# Altium schematic sheet 09-IMC.SchDoc: Impedance Measurement Circuit
size A2; DocumentNumber: 9; SheetNumber: 9; SheetTotal: 15
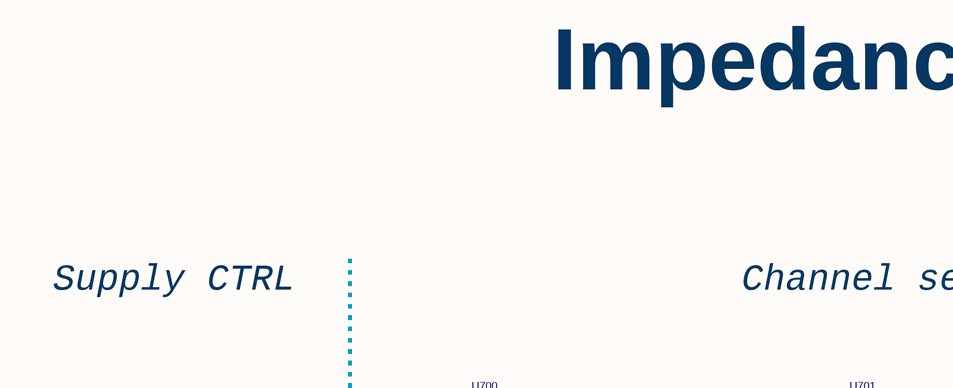
[diagram p0: 09-IMC.SchDoc, top left]
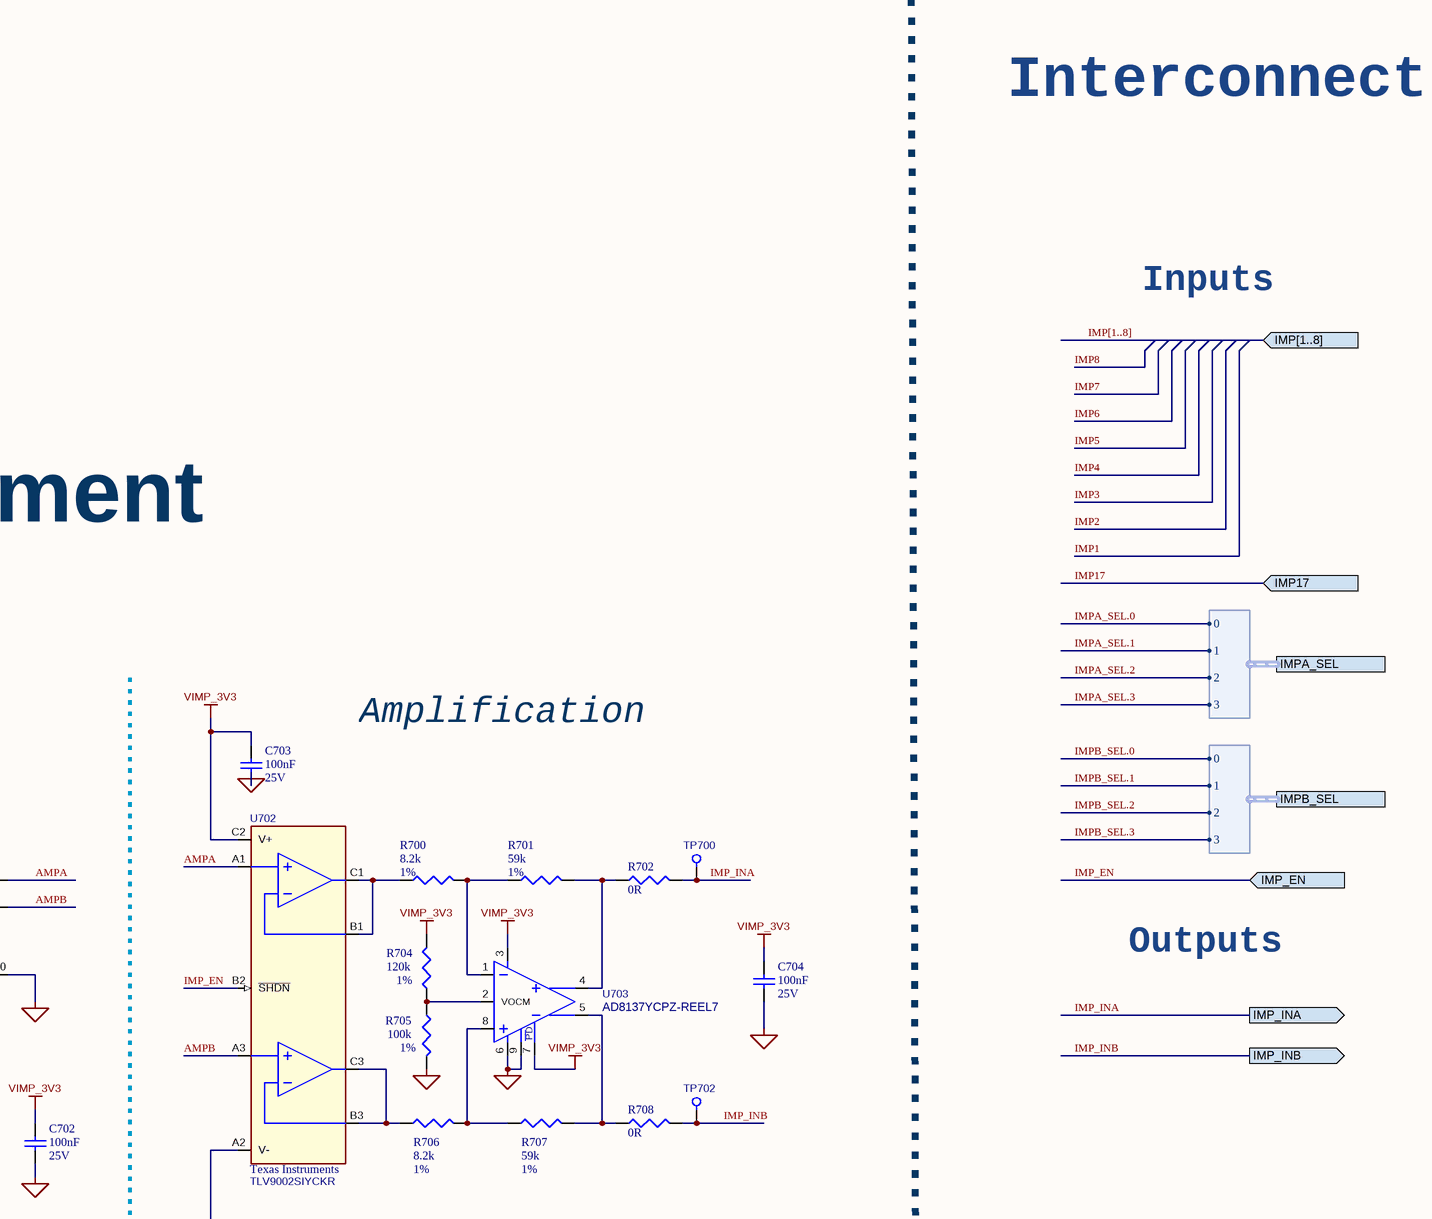
[diagram p1: 09-IMC.SchDoc, top right]
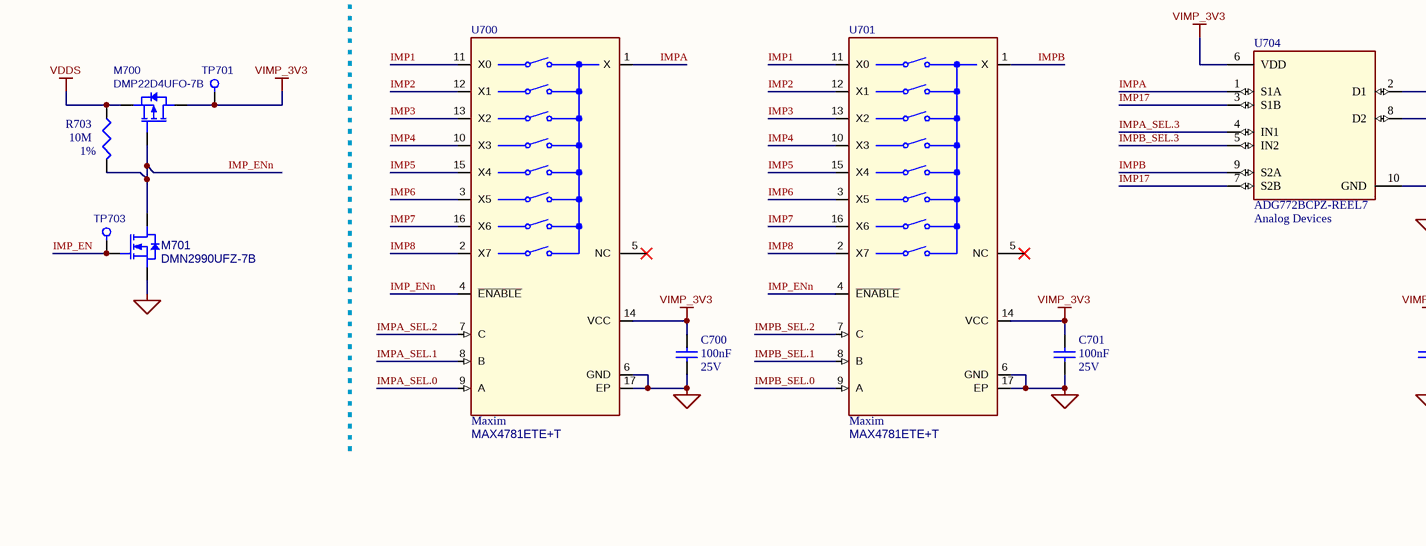
[diagram p2: 09-IMC.SchDoc, bottom left]
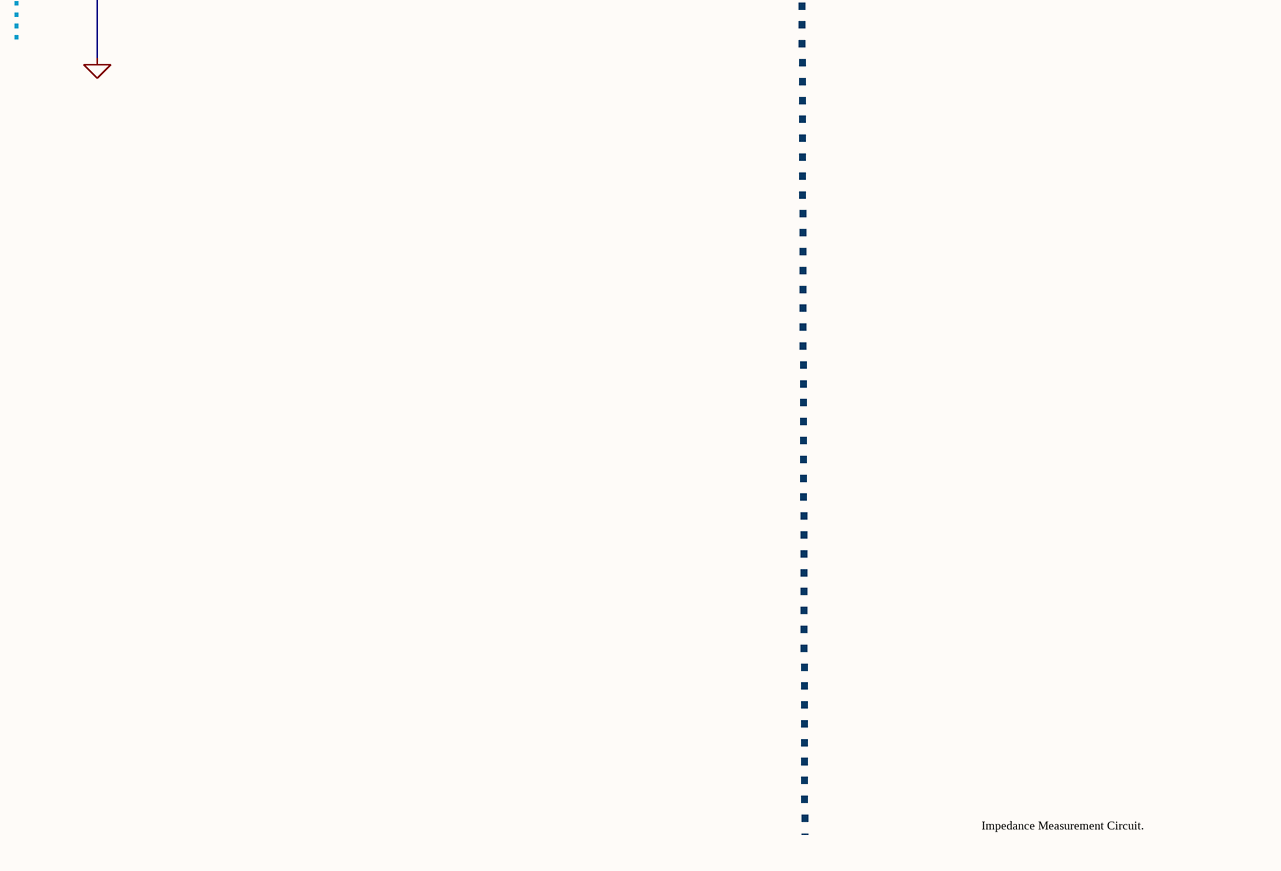
[diagram p3: 09-IMC.SchDoc, bottom right]

## Parts
C700  value 100nF  Rated DC Voltage (URdc): 25V  [C0201_C]  (hidden comment: GRM033R61E104KE14J)
C701  value 100nF  Rated DC Voltage (URdc): 25V  [C0201_C]  (hidden comment: GRM033R61E104KE14J)
C702  value 100nF  Rated DC Voltage (URdc): 25V  [C0201_C]  (hidden comment: GRM033R61E104KE14J)
C703  value 100nF  Rated DC Voltage (URdc): 25V  [C0201_C]  (hidden comment: GRM033R61E104KE14J)
C704  value 100nF  Rated DC Voltage (URdc): 25V  [C0201_C]  (hidden comment: GRM033R61E104KE14J)
M700  DMP22D4UFO-7B  [DIODESINC_X2-DFN0604-3]
M701  DMN2990UFZ-7B  [DIODESINC_X2-DFN0606-3]
R700  value 8.2k  Tolerance: 1%  [R0201_C]  (hidden comment: CRCW02018K20FNED)
R701  value 59k  Tolerance: 1%  [R0201_C]  (hidden comment: CRCW020159K0FNED)
R702  value 0R  [R0201_C]  (hidden comment: CRCW02010000Z0ED)
R703  value 10M  Tolerance: 1%  [R0201_C]  (hidden comment: CRCW020110M0FNED)
R704  value 120k  Tolerance: 1%  [R0201_C]  (hidden comment: CRCW0201120KFNED)
R705  value 100k  Tolerance: 1%  [R0201_C]  (hidden comment: CRCW0201100KFNED)
R706  value 8.2k  Tolerance: 1%  [R0201_C]  (hidden comment: CRCW02018K20FNED)
R707  value 59k  Tolerance: 1%  [R0201_C]  (hidden comment: CRCW020159K0FNED)
R708  value 0R  [R0201_C]  (hidden comment: CRCW02010000Z0ED)
TP700  Test Point  [testpad_0.9mm]  (value not drawn)  (no BOM)
TP701  Test Point  [testpad_0.9mm]  (value not drawn)  (no BOM)
TP702  Test Point  [testpad_0.9mm]  (value not drawn)  (no BOM)
TP703  Test Point  [testpad_0.9mm]  (value not drawn)  (no BOM)
U700  Manufacturer: Maxim  [MAXIM_21-0136]  (hidden comment: MAX4781ETE+T)
U701  Manufacturer: Maxim  [MAXIM_21-0136]  (hidden comment: MAX4781ETE+T)
U702  Manufacturer: Texas Instruments  [TI_YCK0009]  (hidden comment: TLV9002SIYCKR)
U703  AD8137YCPZ-REEL7  [AD_CP-8-13]
U704  ADG772BCPZ-REEL7  Manufacturer: Analog Devices  [10-Lead Mini LFCSP]

## Ports
IMP17 (in), IMP[1..8] (in), IMP_EN (in), IMP_INA (out), IMP_INB (out), IMPA_SEL (harness MUX_SEL), IMPB_SEL (harness MUX_SEL)

## Harnesses
MUX_SEL: 0, 1, 2, 3

## Nets
GND: C700.1 C701.1 C702.1 C703.1 C704.1 M701.2(S) R705.2 U700.6(GND) U700.17(EP) U701.6(GND) U701.17(EP) U702.A2(V-) U703.6(VS-) U703.9(EP) U704.10(GND)
VDDS: M700.2(S) R703.1
VIMP_3V3: C700.2 C701.2 C702.2 C703.2 C704.2 M700.3(D) R704.2 TP701.1 U700.14(VCC) U701.14(VCC) U702.C2(V+) U703.3(VS+) U703.7(~{PD}) U704.6(VDD)
AMPA: U702.A1(IN1+) U704.2(D1)
AMPB: U702.A3(IN2+) U704.8(D2)
IMP1: U700.11(X0) U701.11(X0)
IMP2: U700.12(X1) U701.12(X1)
IMP3: U700.13(X2) U701.13(X2)
IMP4: U700.10(X3) U701.10(X3)
IMP5: U700.15(X4) U701.15(X4)
IMP6: U700.3(X5) U701.3(X5)
IMP7: U700.16(X6) U701.16(X6)
IMP8: U700.2(X7) U701.2(X7)
IMP17: U704.3(S1B) U704.7(S2B) ; port IMP17
IMP_EN: M701.1(G) TP703.1 U702.B2(~{SHDN}) ; port IMP_EN
IMP_ENn: M700.1(G) M701.3(D) R703.2 U700.4(~{ENABLE}) U701.4(~{ENABLE})
IMP_INA: R702.2 TP700.1 ; port IMP_INA
IMP_INB: R708.2 TP702.1 ; port IMP_INB
IMPA: U700.1(X) U704.1(S1A)
IMPA_SEL.0: U700.9(A) ; port IMPA_SEL.0
IMPA_SEL.1: U700.8(B) ; port IMPA_SEL.1
IMPA_SEL.2: U700.7(C) ; port IMPA_SEL.2
IMPA_SEL.3: U704.4(IN1) ; port IMPA_SEL.3
IMPB: U701.1(X) U704.9(S2A)
IMPB_SEL.0: U701.9(A) ; port IMPB_SEL.0
IMPB_SEL.1: U701.8(B) ; port IMPB_SEL.1
IMPB_SEL.2: U701.7(C) ; port IMPB_SEL.2
IMPB_SEL.3: U704.5(IN2) ; port IMPB_SEL.3
NetR700_1: R700.1 U702.B1(IN1-) U702.C1(OUT1)
NetR700_2: R700.2 R701.1 U703.1(-IN)
NetR701_2: R701.2 R702.1 U703.4(+OUT)
NetR704_1: R704.1 R705.1 U703.2(VOCM)
NetR706_1: R706.1 U702.B3(IN2-) U702.C3(OUT2)
NetR706_2: R706.2 R707.1 U703.8(+IN)
NetR707_2: R707.2 R708.1 U703.5(-OUT)

Not connected (* = marked no-connect by the designer): U700 5(NC)*; U701 5(NC)*

## Buses and harness runs
bus IMP[1..8] = port IMP[1..8]

## Notes on the sheet
- Interconnect
- Inputs
- Impedance Measurement
- Supply CTRL
- Channel selection
- Amplification
- Outputs
- Impedance Measurement Circuit.
- Project:
- Schematic:
- Design by:
- Date:
- Ver:
- .
- Comments:
- Reviewed by:
- (in symbol AD8137YCPZ-REEL7) PD

## Library data of the parts
C700-C704 = GRM033R61E104KE14J: Ceramic Capacitor, Multilayer, Ceramic, 25V, 10% +Tol, 10% -Tol, X5R, 15% TC, 0.1uF, Surface Mount, 0201; Manufacturer: Murata; Multilayer: Yes; Category: Ceramic Capacitors; Supplier: Digikey; Supplier Part Number: 490-14571-1-ND; Manufacturer Part Number: GRM033R61E104KE14J; RoHS: Yes; Stock: 1540851; Pricing: 1=0,1, 10=0,033, 50=0,0192, 100=0,0148, 500=0,01118, 1000=0,00878, 2500=0,00798, 5000=0,00734 (USD); Mounting Technology: Surface Mount; Pins: 2; Dielectric Material: Ceramic; Package Shape: Rectangular; Case/Package: 0201; Terminal Finish: Nickel; Min Operating Temperature: -55°C; Max Operating Temperature: 85°C; JESD-609 Code: e3; Capacitor Type: Ceramic; Tolerance  (fill in as +-): 10%; Package Style: SMTMeter; Packaging: Tape and Reel; Tolerance (fill in as +-): 10%; Temperature Characteristics Code: X5R; Termination: Wraparound; Length: 0.6mm; Width: 0.3mm; Height: 0.3mm; Reach SVHC Compliant: Yes; RoHS Compliant: Yes; ComponentLink1URL: https://psearch.en.murata.com:443/capacitor/product/GRM033R61E104KE14%23.pdf?src-supplier=IHS+Markit; ComponentLink1Description: https://psearch.en.murata.com:443/capacitor/product/GRM033R61E104KE14%23.pdf?src-supplier=IHS+Markit; ComponentLink2URL: http://www.mouser.com/ds/2/281/c02e-2905.pdf?src-supplier=Mouser; ComponentLink2Description: http://www.mouser.com/ds/2/281/c02e-2905.pdf?src-supplier=Mouser; ComponentLink3URL: http://search.murata.co.jp/Ceramy/image/img/A01X/G101/ENG/GRM033R61E104KE14-01.pdf?src-supplier=Digikey; ComponentLink3Description: http://search.murata.co.jp/Ceramy/image/img/A01X/G101/ENG/GRM033R61E104KE14-01.pdf?src-supplier=Digikey; ComponentLink4URL: https://search.murata.co.jp/Ceramy/image/img/A01X/G101/ENG/GRM033R61E104KE14-01.pdf?src-supplier=Digikey; ComponentLink4Description: https://search.murata.co.jp/Ceramy/image/img/A01X/G101/ENG/GRM033R61E104KE14-01.pdf?src-supplier=Digikey; Supplier 1: Arrow Electronics; Supplier Part Number 1: GRM033R61E104KE14J
M700 = DMP22D4UFO-7B: MOSFET, P-chan, -20V, -383mA, DFN0604; Manufacturer: Diodes Inc; Medical Grade MFR: TBD; Review: 020823; Category: Transistor; Length (mm): 0.60 ±0.05; Medical Grade MFR PN: TBD; PCB Footprint: TBD; Rating: -20V; Thickness (mm): 0.36 ±0.04; Value: DMP22D4UFO-7B; Width (mm): 0.40 ±0.05; Supplier 1: Digi-Key; Supplier Part Number 1: 31-DMP22D4UFO-7BCT-ND; Status: Approved; Manufacturer Part Number: DMP22D4UFO-7B
M701 = DMN2990UFZ-7B: MOSFET, N-Chan, 20V, 170mA, DFN0606; Manufacturer: Diodes Inc; Medical Grade MFR: TBD; Review: 020823; Category: Transistor; Length (mm): 0.62 ±0.05; Medical Grade MFR PN: TBD; PCB Footprint: TBD; Rating: 20V; Thickness (mm): 0.38 ±0.02; Value: DMN2990UFZ-7B; Width (mm): 0.62 ±0.05; Supplier 1: Digi-Key; Supplier Part Number 1: DMN2990UFZ-7BDICT-ND; Status: Approved; Manufacturer Part Number: DMN2990UFZ-7B
R700 R706 = CRCW02018K20FNED: Fixed Resistor, Metal Glaze/thick Film, 0.05W, 8200ohm, 30V, 1% +/-Tol, 200ppm/Cel, Surface Mount, 0201; Manufacturer: Vishay; Medical Grade MFR: TBD; Power: 50mW; Rated Temperature: 70°C; Temperature Coefficient: 200ppm/°C; Package Height: 0.23mm; Package Length: 0.6mm; Package Width: 0.3mm; Reference Standard: AEC-Q200; Manufacturer Part Number: CRCW02018K20FNED; RoHS: Yes; Category: Chip SMD Resistors; Mounting Technology: Surface Mount; Pins: 2; Package Shape: Rectangular; Case/Package: 0201; Terminal Finish: Nickel; Min Operating Temperature: -55°C; Max Operating Temperature: 155°C; Resistor Type: FIXED RESISTOR; Construction: Chip; Package Style: SMTMeter; Technology: METAL GLAZE/THICK FILM; Termination: Wraparound; Working Voltage: 30V; Reach SVHC Compliant: Yes; RoHS Compliant: Yes; ComponentLink1URL: https://datasheet.ciiva.com:443/pdfs/VipMasterIC/IC/VISH/VISH-S-A0002932828/VISH-S-A0002932828-1.pdf?src-supplier=IHS+Markit; ComponentLink1Description: https://datasheet.ciiva.com:443/pdfs/VipMasterIC/IC/VISH/VISH-S-A0002932828/VISH-S-A0002932828-1.pdf?src-supplier=IHS+Markit; ComponentLink2URL: https://datasheet.ciiva.com/7983/1719906-7983324.pdf?src-supplier=Element14; ComponentLink2Description: https://datasheet.ciiva.com/7983/1719906-7983324.pdf?src-supplier=Element14; ComponentLink3URL: https://datasheet.ciiva.com/7983/1719906-7983323.pdf?src-supplier=Element14; ComponentLink3Description: https://datasheet.ciiva.com/7983/1719906-7983323.pdf?src-supplier=Element14; ComponentLink4URL: https://datasheet.ciiva.com/22692/1719906-22692751.pdf?src-supplier=Element14; ComponentLink4Description: https://datasheet.ciiva.com/22692/1719906-22692751.pdf?src-supplier=Element14; ComponentLink5URL: https://datasheet.ciiva.com/22665/1825492-22665818.pdf?src-supplier=Element14; ComponentLink5Description: https://datasheet.ciiva.com/22665/1825492-22665818.pdf?src-supplier=Element14; ComponentLink6URL: https://datasheet.ciiva.com/2474/crcw0201e3-2474801.pdf?src-supplier=Digikey; ComponentLink6Description: https://datasheet.ciiva.com/2474/crcw0201e3-2474801.pdf?src-supplier=Digikey; ComponentLink7URL: https://datasheet.ciiva.com/2474/crcw0201e3-2474802.pdf?src-supplier=Digikey; ComponentLink7Description: https://datasheet.ciiva.com/2474/crcw0201e3-2474802.pdf?src-supplier=Digikey; ComponentLink8URL: https://datasheet.ciiva.com/2474/crcw0201e3-2474800.pdf?src-supplier=Digikey; ComponentLink8Description: https://datasheet.ciiva.com/2474/crcw0201e3-2474800.pdf?src-supplier=Digikey; ComponentLink9URL: https://datasheet.ciiva.com/22871/70202042-22871422.pdf?src-supplier=Allied+Electronics; ComponentLink9Description: https://datasheet.ciiva.com/22871/70202042-22871422.pdf?src-supplier=Allied+Electronics; ComponentLink10URL: https://datasheet.ciiva.com/3255/crcw0201e3-3255929.pdf?src-supplier=Avnet; ComponentLink10Description: https://datasheet.ciiva.com/3255/crcw0201e3-3255929.pdf?src-supplier=Avnet; Medical Grade MFR PN: TBD; Supplier 1: Digikey; Supplier Part Number 1: 541-CRCW02018K20FNEDCT-ND
R701 R707 = CRCW020159K0FNED: Fixed Resistor, Metal Glaze/thick Film, 0.05W, 59000ohm, 30V, 1% +/-Tol, 200ppm/Cel, Surface Mount, 0201; Manufacturer: Vishay; Medical Grade MFR: TBD; Power: 50mW; Rated Temperature: 70°C; Temperature Coefficient: 200ppm/°C; Package Height: 0.23mm; Package Length: 0.6mm; Package Width: 0.3mm; Reference Standard: AEC-Q200; Manufacturer Part Number: CRCW020159K0FNED; RoHS: Yes; Category: Chip SMD Resistors; Mounting Technology: Surface Mount; Pins: 2; Package Shape: Rectangular; Case/Package: 0201; Terminal Finish: Nickel; Min Operating Temperature: -55°C; Max Operating Temperature: 155°C; Resistor Type: FIXED RESISTOR; Construction: Chip; Package Style: SMTMeter; Technology: METAL GLAZE/THICK FILM; Termination: Wraparound; Working Voltage: 30V; Reach SVHC Compliant: Yes; RoHS Compliant: Yes; ComponentLink1URL: https://datasheet.ciiva.com:443/pdfs/VipMasterIC/IC/VISH/VISH-S-A0002932828/VISH-S-A0002932828-1.pdf?src-supplier=IHS+Markit; ComponentLink1Description: https://datasheet.ciiva.com:443/pdfs/VipMasterIC/IC/VISH/VISH-S-A0002932828/VISH-S-A0002932828-1.pdf?src-supplier=IHS+Markit; ComponentLink2URL: https://datasheet.ciiva.com/7983/1719906-7983324.pdf?src-supplier=Element14; ComponentLink2Description: https://datasheet.ciiva.com/7983/1719906-7983324.pdf?src-supplier=Element14; ComponentLink3URL: https://datasheet.ciiva.com/7983/1719906-7983323.pdf?src-supplier=Element14; ComponentLink3Description: https://datasheet.ciiva.com/7983/1719906-7983323.pdf?src-supplier=Element14; ComponentLink4URL: https://datasheet.ciiva.com/22692/1719906-22692751.pdf?src-supplier=Element14; ComponentLink4Description: https://datasheet.ciiva.com/22692/1719906-22692751.pdf?src-supplier=Element14; ComponentLink5URL: https://datasheet.ciiva.com/22665/1825492-22665818.pdf?src-supplier=Element14; ComponentLink5Description: https://datasheet.ciiva.com/22665/1825492-22665818.pdf?src-supplier=Element14; ComponentLink6URL: https://datasheet.ciiva.com/2474/crcw0201e3-2474801.pdf?src-supplier=Digikey; ComponentLink6Description: https://datasheet.ciiva.com/2474/crcw0201e3-2474801.pdf?src-supplier=Digikey; ComponentLink7URL: https://datasheet.ciiva.com/2474/crcw0201e3-2474802.pdf?src-supplier=Digikey; ComponentLink7Description: https://datasheet.ciiva.com/2474/crcw0201e3-2474802.pdf?src-supplier=Digikey; ComponentLink8URL: https://datasheet.ciiva.com/2474/crcw0201e3-2474800.pdf?src-supplier=Digikey; ComponentLink8Description: https://datasheet.ciiva.com/2474/crcw0201e3-2474800.pdf?src-supplier=Digikey; ComponentLink9URL: https://datasheet.ciiva.com/22871/70202042-22871422.pdf?src-supplier=Allied+Electronics; ComponentLink9Description: https://datasheet.ciiva.com/22871/70202042-22871422.pdf?src-supplier=Allied+Electronics; ComponentLink10URL: https://datasheet.ciiva.com/3255/crcw0201e3-3255929.pdf?src-supplier=Avnet; ComponentLink10Description: https://datasheet.ciiva.com/3255/crcw0201e3-3255929.pdf?src-supplier=Avnet; Medical Grade MFR PN: TBD; Supplier 1: Digikey; Supplier Part Number 1: 541-CRCW020159K0FNEDCT-ND
R702 R708 = CRCW02010000Z0ED: Fixed Resistor, Metal Glaze/thick Film, 0.05W, 0ohm, Surface Mount, 0201; Manufacturer: Vishay; Medical Grade MFR: Mini-Systems; Medical Grade MFR PN: MWA96SM-0000F-NS62TR; Power: 50mW; Rated Temperature: 70°C; Package Height: 0.23mm; Package Length: 0.6mm; Package Width: 0.3mm; Reference Standard: AEC-Q200; Category: Chip SMD Resistors; Supplier: Digikey; Supplier Part Number: 541-0.0AGCT-ND; Manufacturer Part Number: CRCW02010000Z0ED; RoHS: Yes; Stock: 701366; Pricing: 1=0,1, 10=0,034, 25=0,026, 50=0,0198, 100=0,0138, 250=0,01112, 500=0,0089, 1000=0,00655, 5000=0,0047 (USD); Mounting Technology: Surface Mount; Pins: 2; Package Shape: Rectangular; Case/Package: 0201; Terminal Finish: Nickel; Min Operating Temperature: -55°C; Max Operating Temperature: 155°C; JESD-609 Code: e3; Resistor Type: FIXED RESISTOR; Construction: Chip; Package Style: SMTMeter; Packaging: Tape and Reel; Technology: METAL GLAZE/THICK FILM; Termination: Wraparound; Reach SVHC Compliant: Yes; RoHS Compliant: Yes; ComponentLink1URL: https://datasheet.ciiva.com:443/pdfs/VipMasterIC/IC/VISH/VISH-S-A0002932828/VISH-S-A0002932828-1.pdf?src-supplier=IHS+Markit; ComponentLink1Description: https://datasheet.ciiva.com:443/pdfs/VipMasterIC/IC/VISH/VISH-S-A0002932828/VISH-S-A0002932828-1.pdf?src-supplier=IHS+Markit; ComponentLink2URL: https://datasheet.ciiva.com/2471/crcw0201e3-2471712.pdf?src-supplier=Digikey; ComponentLink2Description: https://datasheet.ciiva.com/2471/crcw0201e3-2471712.pdf?src-supplier=Digikey; ComponentLink3URL: https://datasheet.ciiva.com/7841/1719906-7841431.pdf?src-supplier=Element14; ComponentLink3Description: https://datasheet.ciiva.com/7841/1719906-7841431.pdf?src-supplier=Element14; ComponentLink4URL: https://datasheet.ciiva.com/7841/1719906-7841430.pdf?src-supplier=Element14; ComponentLink4Description: https://datasheet.ciiva.com/7841/1719906-7841430.pdf?src-supplier=Element14; ComponentLink5URL: https://datasheet.ciiva.com/22665/1847332-22665688.pdf?src-supplier=Element14; ComponentLink5Description: https://datasheet.ciiva.com/22665/1847332-22665688.pdf?src-supplier=Element14; ComponentLink6URL: https://datasheet.ciiva.com/2471/crcw0201e3-2471713.pdf?src-supplier=Digikey; ComponentLink6Description: https://datasheet.ciiva.com/2471/crcw0201e3-2471713.pdf?src-supplier=Digikey; ComponentLink7URL: https://datasheet.ciiva.com/2471/crcw0201e3-2471711.pdf?src-supplier=Digikey; ComponentLink7Description: https://datasheet.ciiva.com/2471/crcw0201e3-2471711.pdf?src-supplier=Digikey; ComponentLink8URL: https://datasheet.ciiva.com/16757/70202042-16757849.pdf?src-supplier=Allied+Electronics; ComponentLink8Description: https://datasheet.ciiva.com/16757/70202042-16757849.pdf?src-supplier=Allied+Electronics; ComponentLink9URL: https://datasheet.ciiva.com/16436/crcw0201e3-16436237.pdf?src-supplier=Future+Electronics; ComponentLink9Description: https://datasheet.ciiva.com/16436/crcw0201e3-16436237.pdf?src-supplier=Future+Electronics; Supplier 1: Digikey; Supplier Part Number 1: 541-0.0AGDKR-ND
R703 = CRCW020110M0FNED: Fixed Resistor, Metal Glaze/thick Film, 0.05W, 10000000ohm, 30V, 1% +/-Tol, 200ppm/Cel, Surface Mount, 0201; Manufacturer: Vishay Draloric; Medical Grade MFR: Mini-Systems; Medical Grade MFR PN: MWA96SM-1005F-NS62TR; Power: 50mW; Rated Temperature: 70°C; Temperature Coefficient: 200ppm/°C; Category: Chip SMD Resistors; Supplier: Mouser; Supplier Part Number: 71-CRCW020110M0FNED; Manufacturer Part Number: CRCW020110M0FNED; RoHS: Yes; Stock: 159754; Pricing: 1=0,1, 10=0,024, 50=0,024, 100=0,014, 1000=0,011, 10000=0,006 (USD); Mounting Technology: Surface Mount; Pins: 2; Package Shape: Rectangular; Case/Package: 0201; Terminal Finish: Nickel; Min Operating Temperature: -55°C; Max Operating Temperature: 155°C; JESD-609 Code: e3; Resistor Type: FIXED RESISTOR; Packaging: Tape and Reel; Technology: METAL GLAZE/THICK FILM; Termination: Wraparound; Working Voltage: 30V; Reach SVHC Compliant: Yes; RoHS Compliant: Yes; ComponentLink1URL: https://datasheet.ciiva.com:443/pdfs/VipMasterIC/IC/VISH/VISH-S-A0002932828/VISH-S-A0002932828-1.pdf?src-supplier=IHS+Markit; ComponentLink1Description: https://datasheet.ciiva.com:443/pdfs/VipMasterIC/IC/VISH/VISH-S-A0002932828/VISH-S-A0002932828-1.pdf?src-supplier=IHS+Markit; ComponentLink2URL: https://datasheet.ciiva.com/7673/1719906-7673177.pdf?src-supplier=Element14; ComponentLink2Description: https://datasheet.ciiva.com/7673/1719906-7673177.pdf?src-supplier=Element14; ComponentLink3URL: https://datasheet.ciiva.com/7673/1719906-7673178.pdf?src-supplier=Element14; ComponentLink3Description: https://datasheet.ciiva.com/7673/1719906-7673178.pdf?src-supplier=Element14; ComponentLink4URL: https://datasheet.ciiva.com/22692/1719906-22692711.pdf?src-supplier=Element14; ComponentLink4Description: https://datasheet.ciiva.com/22692/1719906-22692711.pdf?src-supplier=Element14; ComponentLink5URL: https://datasheet.ciiva.com/22665/1700795-22665701.pdf?src-supplier=Element14; ComponentLink5Description: https://datasheet.ciiva.com/22665/1700795-22665701.pdf?src-supplier=Element14; Supplier 1: Digikey; Supplier Part Number 1: 541-CRCW020110M0FNEDCT-ND
R704 = CRCW0201120KFNED: Fixed Resistor, Metal Glaze/thick Film, 0.05W, 120000ohm, 30V, 1% +/-Tol, 200ppm/Cel, Surface Mount, 0201; Manufacturer: Vishay Dale; Medical Grade MFR: TBD; Power: 50mW; Rated Temperature: 70°C; Temperature Coefficient: 200ppm/°C; Manufacturer Part Number: CRCW0201120KFNED; RoHS: Yes; Category: Chip SMD Resistors; Mounting Technology: Surface Mount; Pins: 2; Package Shape: Rectangular; Case/Package: 0201; Terminal Finish: Nickel; Min Operating Temperature: -55°C; Max Operating Temperature: 155°C; Resistor Type: FIXED RESISTOR; Technology: METAL GLAZE/THICK FILM; Termination: Wraparound; Working Voltage: 30V; Reach SVHC Compliant: Yes; RoHS Compliant: Yes; ComponentLink1URL: https://datasheet.ciiva.com:443/pdfs/VipMasterIC/IC/VISH/VISH-S-A0002932828/VISH-S-A0002932828-1.pdf?src-supplier=IHS+Markit; ComponentLink1Description: https://datasheet.ciiva.com:443/pdfs/VipMasterIC/IC/VISH/VISH-S-A0002932828/VISH-S-A0002932828-1.pdf?src-supplier=IHS+Markit; ComponentLink2URL: https://datasheet.ciiva.com/7800/1719906-7800943.pdf?src-supplier=Element14; ComponentLink2Description: https://datasheet.ciiva.com/7800/1719906-7800943.pdf?src-supplier=Element14; ComponentLink3URL: https://datasheet.ciiva.com/22682/1700795-22682622.pdf?src-supplier=Element14; ComponentLink3Description: https://datasheet.ciiva.com/22682/1700795-22682622.pdf?src-supplier=Element14; ComponentLink4URL: https://datasheet.ciiva.com/22702/1719906-22702669.pdf?src-supplier=Element14; ComponentLink4Description: https://datasheet.ciiva.com/22702/1719906-22702669.pdf?src-supplier=Element14; ComponentLink5URL: https://datasheet.ciiva.com/29926/crcw0201e3-29926006.pdf?src-supplier=Avnet; ComponentLink5Description: https://datasheet.ciiva.com/29926/crcw0201e3-29926006.pdf?src-supplier=Avnet; Medical Grade MFR PN: TBD; Supplier 1: Digikey; Supplier Part Number 1: 541-CRCW0201120KFNEDDKR-ND
R705 = CRCW0201100KFNED: Fixed Resistor, Metal Glaze/thick Film, 0.05W, 100000ohm, 30V, 1% +/-Tol, 200ppm/Cel, Surface Mount, 0201; Manufacturer: Vishay; Medical Grade MFR: Mini-Systems; Medical Grade MFR PN: MWA96SM-1003F-NS62TR; Power: 50mW; Rated Temperature: 70°C; Temperature Coefficient: 200ppm/°C; Package Height: 0.23mm; Package Length: 0.6mm; Package Width: 0.3mm; Reference Standard: AEC-Q200; Category: Chip SMD Resistors; Supplier: Digikey; Supplier Part Number: 541-100KABCT-ND; Manufacturer Part Number: CRCW0201100KFNED; RoHS: Yes; Stock: 8252; Pricing: 1=0,1, 10=0,037, 50=0,0242, 100=0,0204, 500=0,01426, 1000=0,01241, 5000=0,00924 (USD); Mounting Technology: Surface Mount; Pins: 2; Package Shape: Rectangular; Case/Package: 0201; Terminal Finish: Nickel; Min Operating Temperature: -55°C; Max Operating Temperature: 155°C; JESD-609 Code: e3; Resistor Type: FIXED RESISTOR; Construction: Chip; Package Style: SMTMeter; Packaging: Tape and Reel; Technology: METAL GLAZE/THICK FILM; Termination: Wraparound; Working Voltage: 30V; Reach SVHC Compliant: Yes; RoHS Compliant: Yes; ComponentLink1URL: https://datasheet.ciiva.com:443/pdfs/VipMasterIC/IC/VISH/VISH-S-A0002932828/VISH-S-A0002932828-1.pdf?src-supplier=IHS+Markit; ComponentLink1Description: https://datasheet.ciiva.com:443/pdfs/VipMasterIC/IC/VISH/VISH-S-A0002932828/VISH-S-A0002932828-1.pdf?src-supplier=IHS+Markit; ComponentLink2URL: https://datasheet.ciiva.com/2474/crcw0201e3-2474797.pdf?src-supplier=Digikey; ComponentLink2Description: https://datasheet.ciiva.com/2474/crcw0201e3-2474797.pdf?src-supplier=Digikey; ComponentLink3URL: https://datasheet.ciiva.com/2474/crcw0201e3-2474798.pdf?src-supplier=Digikey; ComponentLink3Description: https://datasheet.ciiva.com/2474/crcw0201e3-2474798.pdf?src-supplier=Digikey; ComponentLink4URL: https://datasheet.ciiva.com/2474/crcw0201e3-2474799.pdf?src-supplier=Digikey; ComponentLink4Description: https://datasheet.ciiva.com/2474/crcw0201e3-2474799.pdf?src-supplier=Digikey; ComponentLink5URL: https://datasheet.ciiva.com/16436/dcrcwe3-16436220.pdf?src-supplier=Future+Electronics; ComponentLink5Description: https://datasheet.ciiva.com/16436/dcrcwe3-16436220.pdf?src-supplier=Future+Electronics; ComponentLink6URL: https://datasheet.ciiva.com/28634/1847332-28634462.pdf?src-supplier=Element14; ComponentLink6Description: https://datasheet.ciiva.com/28634/1847332-28634462.pdf?src-supplier=Element14; ComponentLink7URL: https://datasheet.ciiva.com/22665/1700795-22665689.pdf?src-supplier=Element14; ComponentLink7Description: https://datasheet.ciiva.com/22665/1700795-22665689.pdf?src-supplier=Element14; ComponentLink8URL: https://datasheet.ciiva.com/22870/70202042-22870476.pdf?src-supplier=Allied+Electronics; ComponentLink8Description: https://datasheet.ciiva.com/22870/70202042-22870476.pdf?src-supplier=Allied+Electronics; ComponentLink9URL: https://datasheet.ciiva.com/16777/70202042-16777655.pdf?src-supplier=Allied+Electronics; ComponentLink9Description: https://datasheet.ciiva.com/16777/70202042-16777655.pdf?src-supplier=Allied+Electronics; Supplier 1: Digikey; Supplier Part Number 1: 541-100KABCT-ND
TP700-TP703 = Test Point: Test pad, 0.90mm circular pad; PCB Footprint: testpad_0p90mm; Length (mm): 0.90; Manufacturer: N/A; Manufacturer PN: N/A; Medical Grade MFR: N/A; Medical Grade MFR PN: N/A; Rating: N/A; Thickness (mm): N/A; Value: Test point; Width (mm): 0.90; Category: Test point; Status: *; Review: *
U700 U701 = MAX4781ETE+T: Multiplexer, 8:1, 0.7 ohms, QFN-16; Medical Grade MFR: TBD; Category: IC; Length (mm): 3.00 ±0.10; Medical Grade MFR PN: TBD; Package Description: TBD; PCB Footprint: TBD; Rating: TBD; Thickness (mm): 0.75 ±0.05; Value: MAX4781ETE+T; Width (mm): 3.00 ±0.10; Supplier 1: Digi-Key; Supplier Part Number 1: MAX4781ETE+TCT-ND; Status: *; Review: *; Manufacturer Part Number: MAX4781ETE+T
U702 = TLV9002SIYCKR_B: Op Amp, Dual, Rail-to-Rail, 1MHz, BGA-9; Medical Grade MFR: TBD; Rating: 5.5V; Category: IC; Length (mm): 0.95 ±0.03; Medical Grade MFR PN: TBD; PCB Footprint: TBD; Thickness (mm): 0.33; Value: TLV9002SIYCKR; Width (mm): 0.95 ±0.03; Package Description: TBD; Supplier 1: Mouser; Supplier Part Number 1: 595-TLV9002SIYCKR; Status: *; Review: *; Manufacturer Part Number: TLV9002SIYCKR
U703 = AD8137YCPZ-REEL7: Differential Amplifier, 110 MHz, DFN-8; Manufacturer: Analog Devices; Medical Grade MFR: TBD; Category: IC; Length (mm): 3.00 ±0.10; Medical Grade MFR PN: TBD; Package Description: TBD; PCB Footprint: TBD; Rating: TBD; Thickness (mm): 0.75 ±0.05; Value: AD8137YCPZ-REEL7; Width (mm): 3.00 ±0.10; Supplier 1: Digi-Key; Supplier Part Number 1: 505-AD8137YCPZ-REEL7CT-ND; Status: *; Review: *; Manufacturer Part Number: AD8137YCPZ-REEL7
U704 = ADG772BCPZ-REEL7: SPDT, 2 Func, 1 Channel, CMOS; Number of Channels: 1; Channels: 2; Off-state Isolation-Nom: 73dB; On-state Resistance Match-Nom: 40mR; On-state Resistance-Max (Ron): 8.8R; Max Supply Voltage: 3.6V; Min Supply Voltage: 2.7V; Nominal Supply Voltage: 3.3V; Switch-off Time-Max: 9.5ns; Switch-on Time-Max: 12.5ns; Power Supplies: 3/3.3V; Switching: BREAK-BEFORE-MAKEV; Time @ Peak Reflow Temperature-Max (s): 40s; Supply Current-Max (Isup): 1uA; Qualification Status: Not Qualified; Supplier: Arrow Electronics; Supplier Part Number: ADG772BCPZ-REEL7; Manufacturer Part Number: ADG772BCPZ-REEL7; RoHS: Yes; Category: Interface ICs; Stock: 2157; Pricing: 1=2,564, 10=2,288, 25=2,22, 100=1,902, 250=1,788, 500=1,61, 1000=1,321 (USD); Case/Package: VQCCN; Pins: 10; Package Shape: Rectangular; Terminal Finish: Nickel; Min Operating Temperature: -40°C; Max Operating Temperature: 85°C; JESD-609 Code: e4; Throw Configuration: SPDT; Package Style: CHIP CARRIER, VERY THIN PROFILEMeter; Surface Mount: Yes; Technology: CMOS; Terminal Form: No Lead; Terminal Position: QUAD; Moisture Sensitivity Level: 1; Peak Reflow Temperature (Cel): 260°C; Length: 1.6mm; Width: 1.3mm; Height - Seated (Max): 0.6mm; Terminal Pitch: 0.4mm; Temperature Grade: INDUSTRIAL; RoHS Compliant: Yes; Reach SVHC Compliant: Yes; ComponentLink1URL: https://datasheet.ciiva.com:443/pdfs/VipMasterIC/IC/ANDI/ANDI-S-A0002823372/ANDI-S-A0002823372-1.pdf?src-supplier=IHS+Markit; ComponentLink1Description: https://datasheet.ciiva.com:443/pdfs/VipMasterIC/IC/ANDI/ANDI-S-A0002823372/ANDI-S-A0002823372-1.pdf?src-supplier=IHS+Markit; ComponentLink2URL: https://datasheet.ciiva.com/16230/adg772-246565-16230035.pdf?src-supplier=Mouser; ComponentLink2Description: https://datasheet.ciiva.com/16230/adg772-246565-16230035.pdf?src-supplier=Mouser; ComponentLink3URL: https://datasheet.ciiva.com/15127/getdatasheetpartid-305178-15127686.pdf?src-supplier=Verical; ComponentLink3Description: https://datasheet.ciiva.com/15127/getdatasheetpartid-305178-15127686.pdf?src-supplier=Verical; ComponentLink4URL: https://datasheet.ciiva.com/2980/adg772-2980261.pdf?src-supplier=Avnet; ComponentLink4Description: https://datasheet.ciiva.com/2980/adg772-2980261.pdf?src-supplier=Avnet; ComponentLink5URL: https://datasheet.ciiva.com/6638/adg772-6638955.pdf?src-supplier=Digi-Key; ComponentLink5Description: https://datasheet.ciiva.com/6638/adg772-6638955.pdf?src-supplier=Digi-Key; ComponentLink6URL: https://datasheet.ciiva.com/6638/adg772-6638957.pdf?src-supplier=Digi-Key; ComponentLink6Description: https://datasheet.ciiva.com/6638/adg772-6638957.pdf?src-supplier=Digi-Key; ComponentLink7URL: https://datasheet.ciiva.com/6638/adg772-6638958.pdf?src-supplier=Digi-Key; ComponentLink7Description: https://datasheet.ciiva.com/6638/adg772-6638958.pdf?src-supplier=Digi-Key; Supplier 1: Mouser; Supplier Part Number 1: 584-ADG772BCPZ-R7